# Altium schematic sheet RF PATH.SchDoc: RF PATH
size B; SheetNumber: 5; SheetTotal: 9
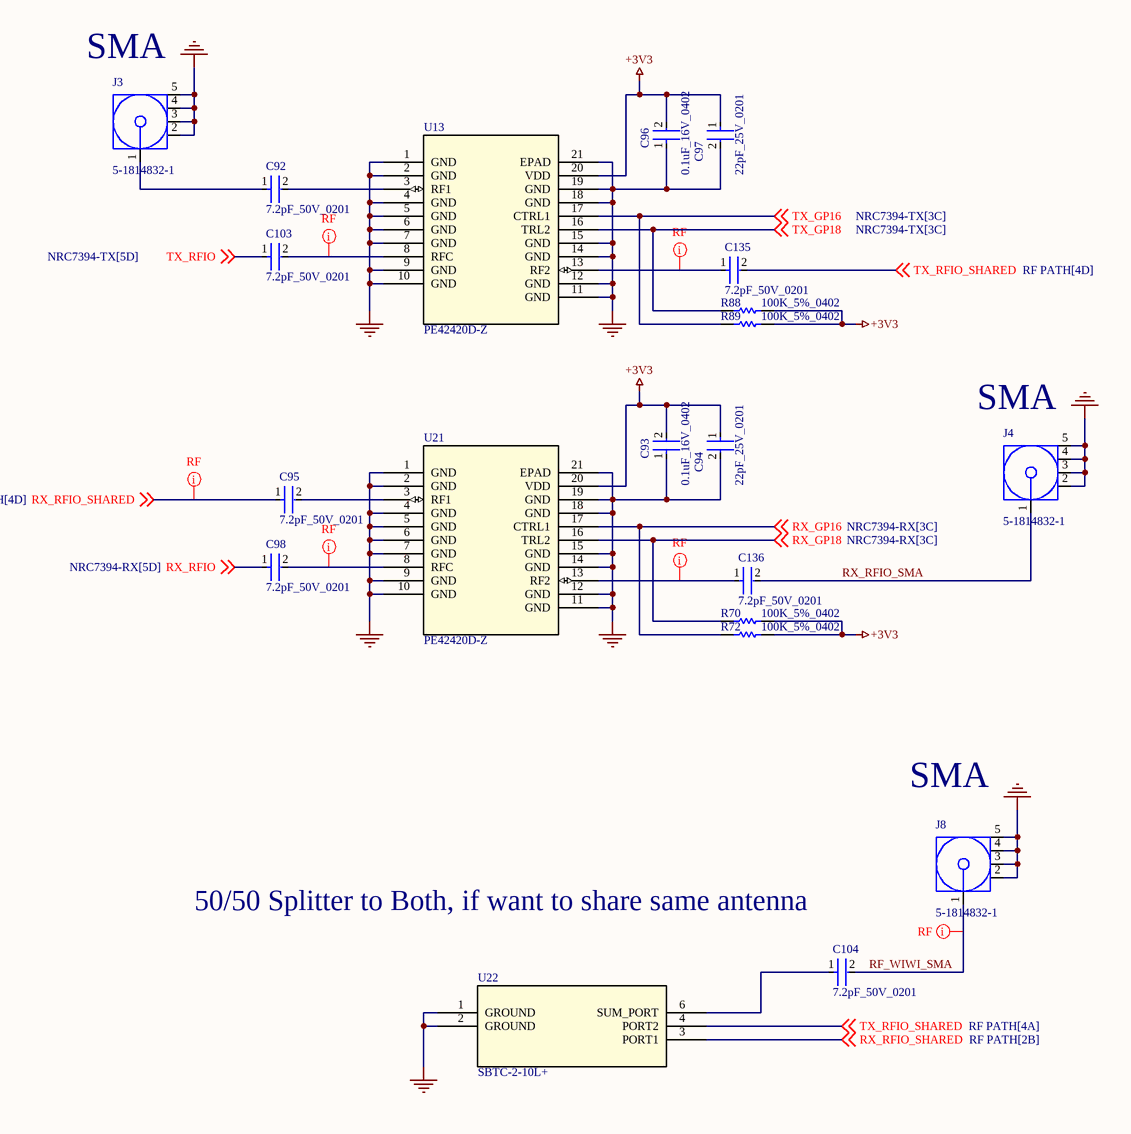
[diagram p0: RF PATH.SchDoc]

## Parts
C92  7.2pF_50V_0201  [FP-GRM033-0_03-IPC_B]
C93  0.1uF_16V_0402  [FP-C0402-BB-MFG]
C94  22pF_25V_0201  [FP-0201-L_0_6_0_09-W_0_3-MFG]
C95  7.2pF_50V_0201  [FP-GRM033-0_03-IPC_B]
C96  0.1uF_16V_0402  [FP-C0402-BB-MFG]
C97  22pF_25V_0201  [FP-0201-L_0_6_0_09-W_0_3-MFG]
C98  7.2pF_50V_0201  [FP-GRM033-0_03-IPC_B]
C103  7.2pF_50V_0201  [FP-GRM033-0_03-IPC_B]
C104  7.2pF_50V_0201  [FP-GRM033-0_03-IPC_B]
C135  7.2pF_50V_0201  [FP-GRM033-0_03-IPC_B]
C136  7.2pF_50V_0201  [FP-GRM033-0_03-IPC_B]
J3  5-1814832-1  [TECO-5-1814832-1_V]
J4  5-1814832-1  [TECO-5-1814832-1_V]
J8  5-1814832-1  [TECO-5-1814832-1_V]
R70  100K_5%_0402  [RESC1005X37X25ML05T10]
R72  100K_5%_0402  [RESC1005X37X25ML05T10]
R88  100K_5%_0402  [RESC1005X37X25ML05T10]
R89  100K_5%_0402  [RESC1005X37X25ML05T10]
U13  PE42420D-Z  [LGA20_4X4_PSM]
U21  PE42420D-Z  [LGA20_4X4_PSM]
U22  SBTC-2-10L+  [AT1029_MNC]

## Nets
+3V3: C93.2 C94.1 C96.2 C97.1 R70.1 R72.1 R88.1 R89.1 U13.20(VDD) U21.20(VDD)
GND: C93.1 C94.2 C96.1 C97.2 J3.2 J3.3 J3.4 J3.5 J4.2 J4.3 J4.4 J4.5 J8.2 J8.3 J8.4 J8.5 U13.1(GND) U13.2(GND) U13.4(GND) U13.5(GND) U13.6(GND) U13.7(GND) U13.9(GND) U13.10(GND) U13.11(GND) U13.12(GND) U13.14(GND) U13.15(GND) U13.18(GND) U13.19(GND) U13.21(EPAD) U21.1(GND) U21.2(GND) U21.4(GND) U21.5(GND) U21.6(GND) U21.7(GND) U21.9(GND) U21.10(GND) U21.11(GND) U21.12(GND) U21.14(GND) U21.15(GND) U21.18(GND) U21.19(GND) U21.21(EPAD) U22.1(GROUND) U22.2(GROUND)
RF_WIWI_SMA: C104.2 J8.1
RX_GP16: R72.2 U21.17(CTRL1) ; off-sheet RX_GP16
RX_GP18: R70.2 U21.16(TRL2) ; off-sheet RX_GP18
RX_RFIO: C98.1 ; off-sheet RX_RFIO
RX_RFIO_SHARED: C95.1 U22.3(PORT1) ; off-sheet RX_RFIO_SHARED
RX_RFIO_SMA: C136.2 J4.1
TX_GP16: R89.2 U13.17(CTRL1) ; off-sheet TX_GP16
TX_GP18: R88.2 U13.16(TRL2) ; off-sheet TX_GP18
TX_RFIO: C103.1 ; off-sheet TX_RFIO
TX_RFIO_SHARED: C135.2 U22.4(PORT2) ; off-sheet TX_RFIO_SHARED
NetC92_1: C92.1 J3.1
NetC92_2: C92.2 U13.3(RF1)
NetC95_2: C95.2 U21.3(RF1)
NetC98_2: C98.2 U21.8(RFC)
NetC103_2: C103.2 U13.8(RFC)
NetC104_1: C104.1 U22.6(SUM_PORT)
NetC135_1: C135.1 U13.13(RF2)
NetC136_1: C136.1 U21.13(RF2)

## Layout directives
net class RF: NetC98_2, NetC103_2, NetC135_1, NetC136_1, RF_WIWI_SMA, RX_RFIO_SHARED

## Notes on the sheet
- (near J3) SMA
- (near J4) SMA
- (near J8) SMA
- (near J8) 50/50 Splitter to Both, if want to share same antenna

## Library data of the parts
C92 C95 C98 C103 C104 C135 C136 = CMP-06035-014494-1: Chip Multilayer Ceramic Capacitors for General Purpose, 0201, 7.2pF, C0G, 30ppm/°C, 0.1pF, 50V; Capacitance: 7.2pF; Voltage Rating: 50V; Package Quantity: 15000; Thickness: 0.013inch; Voltage Rating (DC): 50V; Max Operating Temperature: 125°C; Mount: Surface Mount; Case/Package: 0201; Packaging: Tape and Reel; Case Code (Imperial): 0201; Height: 0.3mm; Min Operating Temperature: -55°C; Width: 0.3mm; Termination: SMD/SMT; Length: 0.024inch; Case Code (Metric): 0603; Dielectric: C0G
C93 C96 = CMP-2008-02094-2: CAP CER 0.1UF 16V 20% X7R 0402; Manufacturer: Kemet; Manufacturer Part Number: C0402C104M4RACTU; Temperature Coefficient: 15%; Material: Ceramic; Capacitance: 0.10 μF; Tolerance: 0.2; Value: 0.10 μF; Temperature Range High: +125°C; Device Class L3: Ceramic Capacitors; Category: Cap; RoHS: TRUE; ComponentLink2URL: https://content.kemet.com/datasheets/KEM_C1002_X7R_SMD.pdf; Temperature: -55°C to +125°C; Octopart: https://octopart.com/c0402c104m4ractu-kemet-10476575; Automotive: No; Height: 0.55mm; ComponentLink2Description: Datasheet; Device Class L2: Capacitors; Voltage Rating: 16 V; Device Class L1: Passive Components; Temperature Characteristic: X7R; Lead Free: Yes; Digikey Description: CAP CER 0.1UF 16V 20% X7R 0402; Mouser Description: Multilayer Ceramic Capacitors MLCC - SMD/SMT 16volts 0.1uF X7R 20%; Temperature Range Low: -55°C; Ipc Land Pattern Name: CAPC10050X50; Package: C0402-BB
C94 C97 = CMP-2010-00022-2: General Purpose Ceramic Capacitor, 0201, 22pF, 5%, C0G, 30ppm/°C, 25V; Depth: 0.3mm; Termination: SMD/SMT; Voltage: 25V; Packaging: Tape and Reel; Radiation Hardening: No; Package Quantity: 1; Case/Package: 0201; Case Code (Metric): 0603; Thickness: 0.013inch; Tolerance: 5%; Voltage Rating (DC): 25V; Voltage Rating: 25V; Number of Pins: 2; Dielectric: C0G; Height: 0.33mm; Capacitance: 22pF; Min Operating Temperature: -55°C; RoHS Compliant: Yes; Lead Free: Lead Free; Length: 0.6mm; Series: -; REACH SVHC: No SVHC; Width: 0.3mm; Construction: Flat; Case Code (Imperial): 0201; Mount: Surface Mount; Max Operating Temperature: 125°C; Temperature Coefficient: 30ppm/°C
J3 J4 J8 = CMP-2000-05415-1: SMA Connector, Pitch 5.08 mm, 1 Position, Height 9.5 mm, Tail Length 4 mm, -65 to 165 degC, RoHS, Bulk; Manufacturer: TE Connectivity; Connector Mounting: PCBMount; Connector Body Style: StraightJack; Impedance: 50ohm; Coaxial Termination: Solder; SVHC: NoSVHC(15-Jun-2015); Frequency Max: 3GHz; Product Range: ZDCSeries; Connector Type: SMACoaxial; Datasheet Version: Rev. B1, 03/2011; Package Reference: 5-1814832-1; Package Description: SMA Connector, Pitch 5.08 mm, 1 Position, Height 9.5 mm, Tail Length 4 mm; Contact Plating: GoldPlatedContacts; Coaxial Cable Types: -; Contact Material: BerylliumCopper; Manufacturer URL: http://www.te.com/; Datasheet URL: http://www.onlinecomponents.com/productFiles/mf-AMP/eng_cd_1814832_a.pdf
R70 R72 R88 R89 = CMP-2002-01850-1: Part Number: RE0402DR-07100KL; Manufacturer: Yageo / Phycomp
U13 U21 = PE42420D-Z: No Description Available; Mfr_Name: pSemi; RefDes: RefDes; Type: Type
U22 = SBTC-2-10L+: No Description Available; Mfr_Name: Mini Circuits; Copyright: Copyright (C) 2023 Ultra Librarian. All rights reserved.; Manufacturer_Part_Number: SBTC-2-10L+; RefDes: RefDes; Type: DEV